# Altium project BinaryClock.PrjPCB
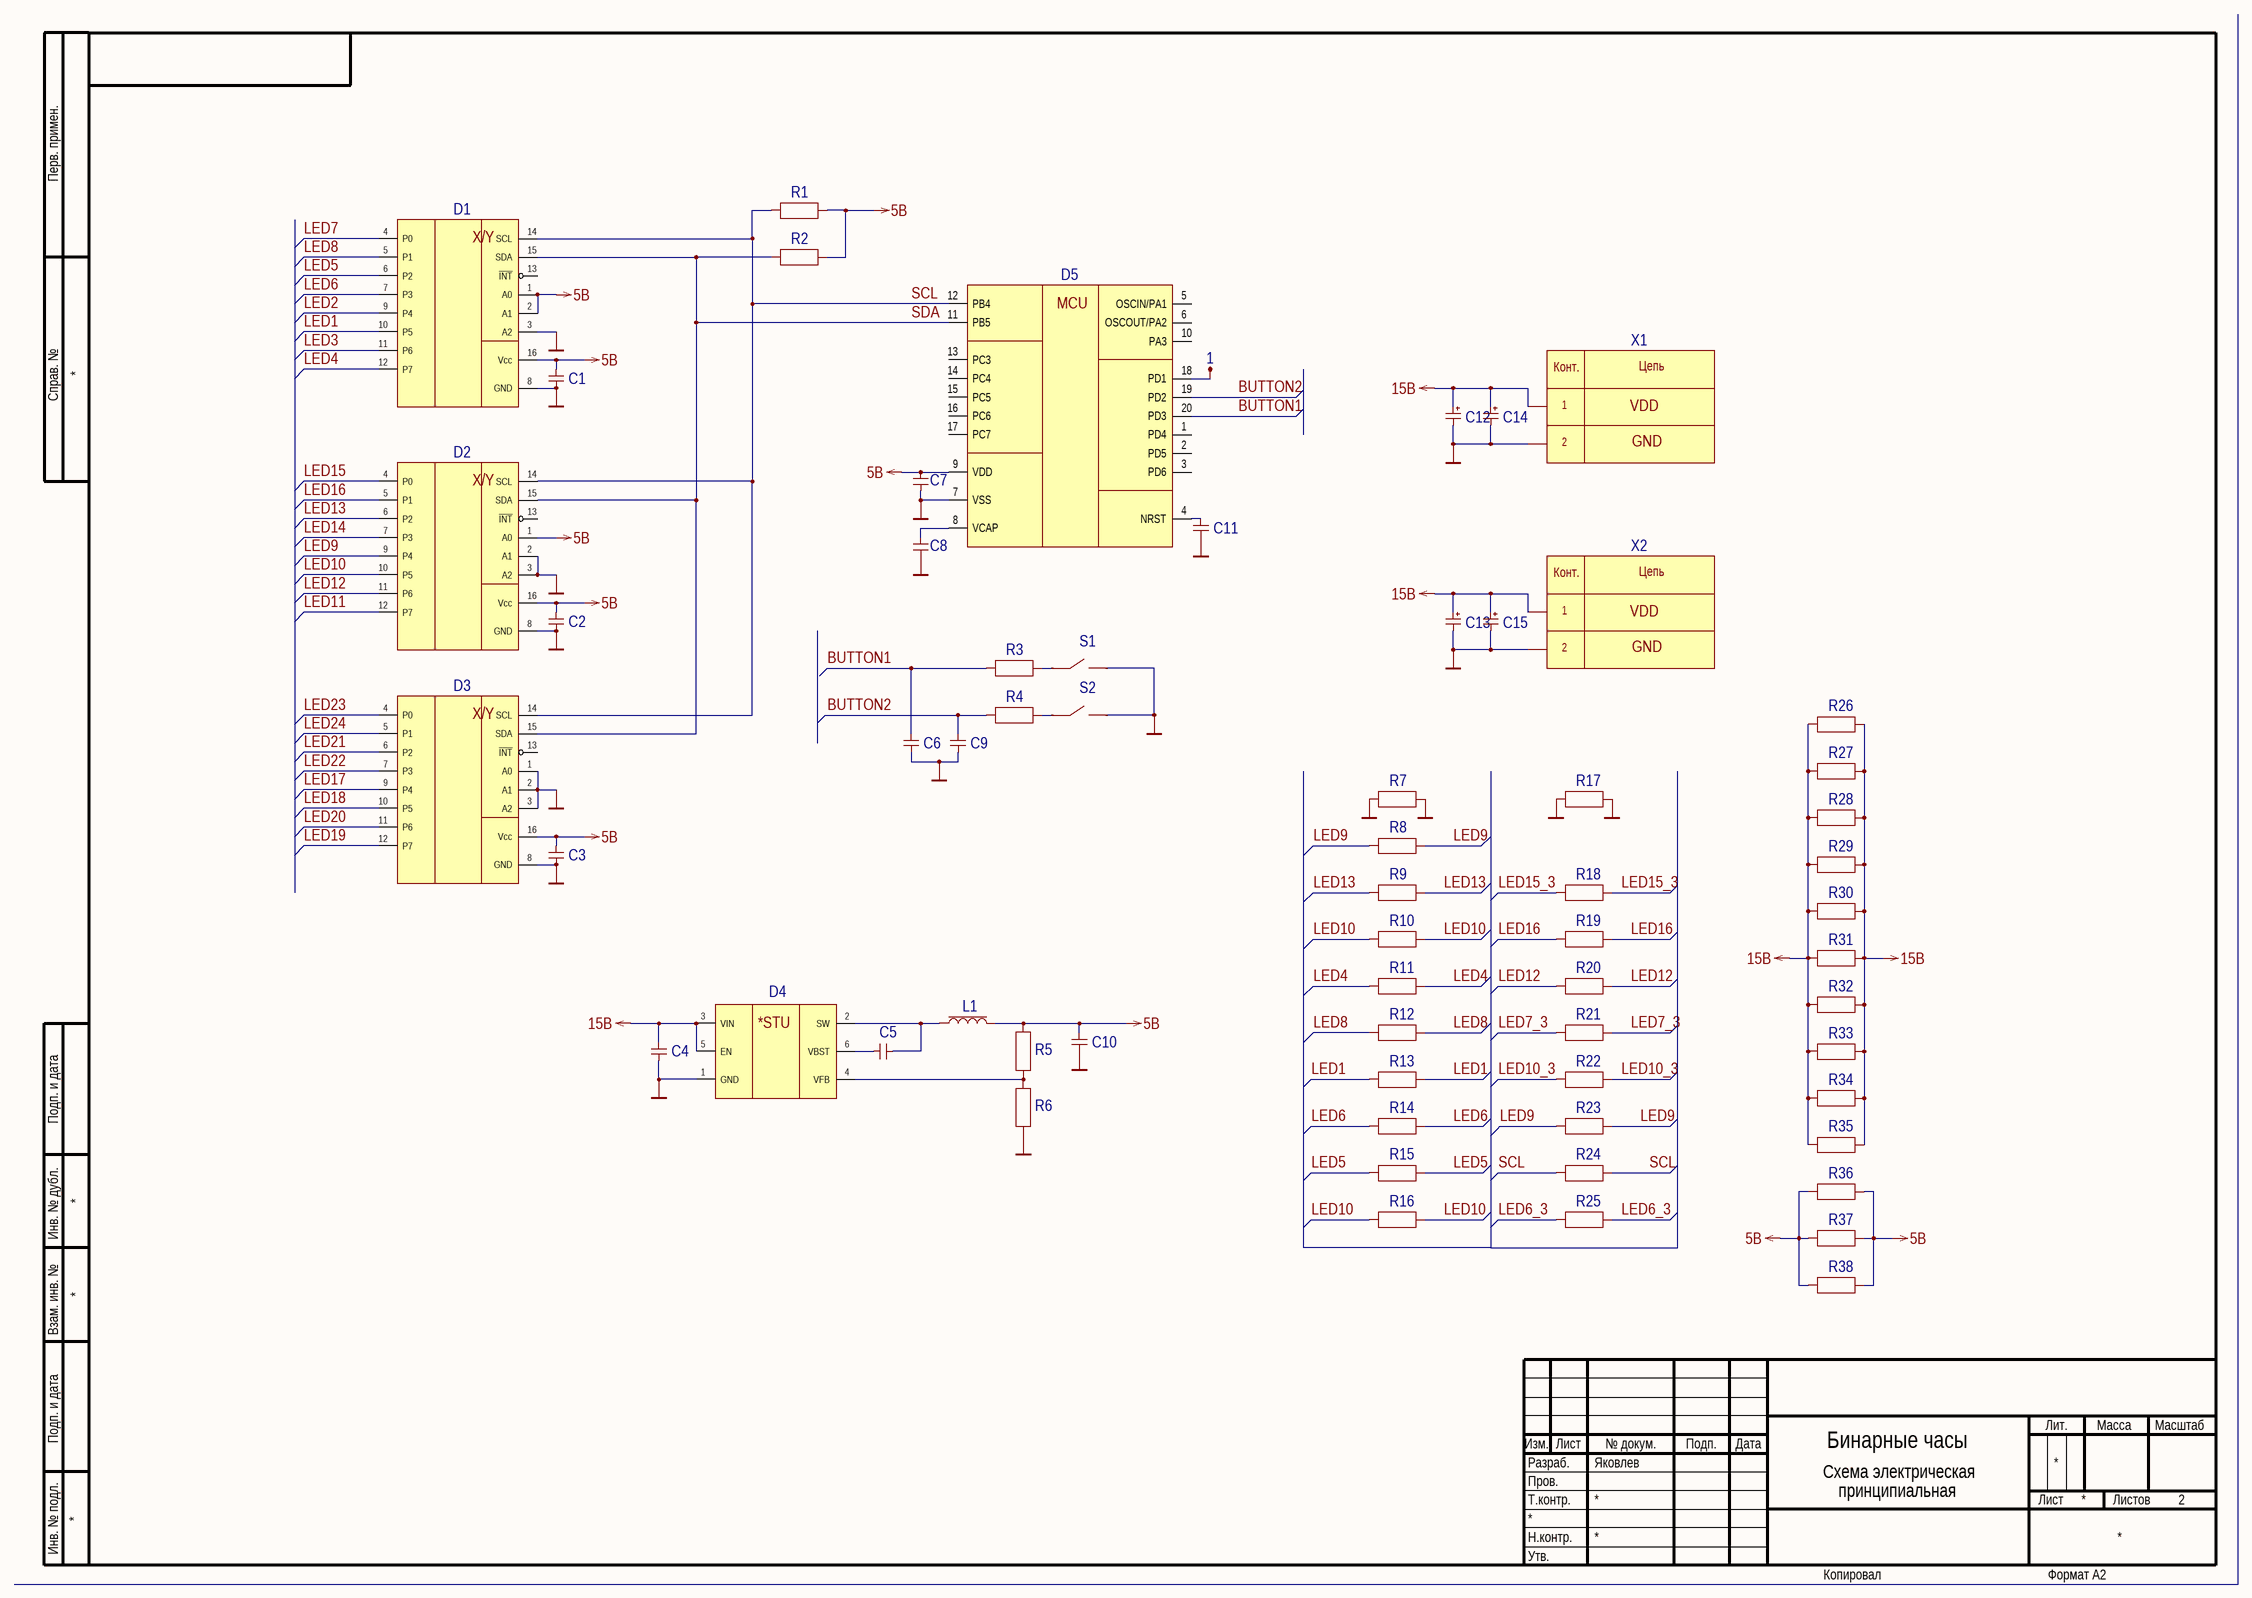
[diagram p0: BinaryClock_Control.SchDoc]
2 sheets, 112 parts. Net scope: global (net labels, ports and power ports of the same name join across sheets).
Board file: BinaryClock.PcbDoc
Sheets:
  BinaryClock_Control.SchDoc
  BinaryClock_LEDs.SchDoc

## Sheet BinaryClock_Control.SchDoc
size 594 x 420 mm; Scale: 1:1; Разраб.: Яковлев; Общее количество листов: 2; Наименование изделия 1: Бинарные часы; Наименование изделия 2: Схема электрическая; Наименование изделия 3: принципиальная

### Parts
1  Point  [point]  (value not drawn)
C1  0805-16 В-X7R-0,1мкФ±10 %  [SMD-0805C]  (value not drawn)
C2  0805-16 В-X7R-0,1мкФ±10 %  [SMD-0805C]  (value not drawn)
C3  0805-16 В-X7R-0,1мкФ±10 %  [SMD-0805C]  (value not drawn)
C4  1206-16 В-X7R-22мкФ±10 %  [SMD-1206C]  (value not drawn)
C5  0805-16 В-X7R-0,1мкФ±10 %  [SMD-0805C]  (value not drawn)
C6  0805-16 В-X7R-0,1мкФ±10 %  [SMD-0805C]  (value not drawn)
C7  0805-16 В-X7R-0,1мкФ±10 %  [SMD-0805C]  (value not drawn)
C8  0805-16 В-X7R-1мкФ±10 %  [SMD-0805C]  (value not drawn)
C9  0805-16 В-X7R-0,1мкФ±10 %  [SMD-0805C]  (value not drawn)
C10  1206-16 В-X7R-22мкФ±10 %  [SMD-1206C]  (value not drawn)
C11  0805-16 В-X7R-0,1мкФ±10 %  [SMD-0805C]  (value not drawn)
C12  D-20 В-47 мкФ±10 %  [CAP POL 2917/7343]  (value not drawn)
C13  D-20 В-47 мкФ±10 %  [CAP POL 2917/7343]  (value not drawn)
C14  D-20 В-47 мкФ±10 %  [CAP POL 2917/7343]  (value not drawn)
C15  D-20 В-47 мкФ±10 %  [CAP POL 2917/7343]  (value not drawn)
D1  PCF8574T/3.512  [SO-16]  (value not drawn)
D2  PCF8574T/3.512  [SO-16]  (value not drawn)
D3  PCF8574T/3.512  [SO-16]  (value not drawn)
D4  TPS562200DDCT  [SOT23-6_M]  (value not drawn)
D5  STM8S103F3P6  [TSSOP-20]  (value not drawn)
L1  NLCV32T-4R7M-EF  [1210_M]  (value not drawn)
R1  0805±5 %-10 кОм  [SMD-0805-RES]  (value not drawn)
R2  0805±5 %-10 кОм  [SMD-0805-RES]  (value not drawn)
R3  0805±5 %-100 Ом  [SMD-0805-RES]  (value not drawn)
R4  0805±5 %-100 Ом  [SMD-0805-RES]  (value not drawn)
R5  0805±1 %-56,2 кОм  [SMD-0805-RES]  (value not drawn)
R6  0805±1 %-10,2 кОм  [SMD-0805-RES]  (value not drawn)
R7  0805±5 %-0 Ом  [R1206]  (value not drawn)
R8  0805±5 %-0 Ом  [R1206]  (value not drawn)
R9  0805±5 %-0 Ом  [R1206]  (value not drawn)
R10  0805±5 %-0 Ом  [R1206]  (value not drawn)
R11  0805±5 %-0 Ом  [R1206]  (value not drawn)
R12  0805±5 %-0 Ом  [R1206]  (value not drawn)
R13  0805±5 %-0 Ом  [R1206]  (value not drawn)
R14  0805±5 %-0 Ом  [R1206]  (value not drawn)
R15  0805±5 %-0 Ом  [R1206]  (value not drawn)
R16  0805±5 %-0 Ом  [R1206]  (value not drawn)
R17  0805±5 %-0 Ом  [R1206]  (value not drawn)
R18  0805±5 %-0 Ом  [R1206]  (value not drawn)
R19  0805±5 %-0 Ом  [R1206]  (value not drawn)
R20  0805±5 %-0 Ом  [R1206]  (value not drawn)
R21  0805±5 %-0 Ом  [R1206]  (value not drawn)
R22  0805±5 %-0 Ом  [R1206]  (value not drawn)
R23  0805±5 %-0 Ом  [R1206]  (value not drawn)
R24  0805±5 %-0 Ом  [R1206]  (value not drawn)
R25  0805±5 %-0 Ом  [R1206]  (value not drawn)
R26  0805±5 %-0 Ом  [R1206]  (value not drawn)
R27  0805±5 %-0 Ом  [R1206]  (value not drawn)
R28  0805±5 %-0 Ом  [R1206]  (value not drawn)
R29  0805±5 %-0 Ом  [R1206]  (value not drawn)
R30  0805±5 %-0 Ом  [R1206]  (value not drawn)
R31  0805±5 %-0 Ом  [R1206]  (value not drawn)
R32  0805±5 %-0 Ом  [R1206]  (value not drawn)
R33  0805±5 %-0 Ом  [R1206]  (value not drawn)
R34  0805±5 %-0 Ом  [R1206]  (value not drawn)
R35  0805±5 %-0 Ом  [R1206]  (value not drawn)
R36  0805±5 %-0 Ом  [R1206]  (value not drawn)
R37  0805±5 %-0 Ом  [R1206]  (value not drawn)
R38  0805±5 %-0 Ом  [R1206]  (value not drawn)
S1  1243SHIM-160G-G  [1243S]  (value not drawn)
S2  1243SHIM-160G-G  [1243S]  (value not drawn)
X1  RASM712X  [RASM712]  (value not drawn)
X2  RASM712X  [RASM712]  (value not drawn)

### Nets
5В: C1.2 C2.2 C3.2 C7.2 C10.2 D1.1(A0) D1.2(A1) D1.16(Vcc) D2.1(A0) D2.16(Vcc) D3.16(Vcc) D5.9(VDD) L1.2 R1.2 R2.2 R5.2 R36.1 R36.2 R37.1 R37.2 R38.1 R38.2
15В: C4.2 C12.1 C13.1 C14.1 C15.1 D4.3(VIN) D4.5(EN) R26.1 R26.2 R27.1 R27.2 R28.1 R28.2 R29.1 R29.2 R30.1 R30.2 R31.1 R31.2 R32.1 R32.2 R33.1 R33.2 R34.1 R34.2 R35.1 R35.2 X1.1 X2.1
GND: C1.1 C2.1 C3.1 C4.1 C6.1 C7.1 C8.1 C9.1 C10.1 C11.1 C12.2 C13.2 C14.2 C15.2 D1.3(A2) D1.8(GND) D2.2(A1) D2.3(A2) D2.8(GND) D3.1(A0) D3.2(A1) D3.3(A2) D3.8(GND) D4.1(GND) D5.7(VSS) R6.1 R7.1 R7.2 R17.1 R17.2 S1.2 S2.2 X1.2 X2.2
BUTTON1: C6.2 D5.20(PD3) R3.1
BUTTON2: C9.2 D5.19(PD2) R4.1
LED1: D1.10(P5) R13.1 R13.2
LED2: D1.9(P4)
LED3: D1.11(P6)
LED4: D1.12(P7) R11.1 R11.2
LED5: D1.6(P2) R15.1 R15.2
LED6: D1.7(P3) R14.1 R14.2
LED6_3: R25.1 R25.2
LED7: D1.4(P0)
LED7_3: R21.1 R21.2
LED8: D1.5(P1) R12.1 R12.2
LED9: D2.9(P4) R8.1 R8.2 R23.1 R23.2
LED10: D2.10(P5) R10.1 R10.2 R16.1 R16.2
LED10_3: R22.1 R22.2
LED11: D2.12(P7)
LED12: D2.11(P6) R20.1 R20.2
LED13: D2.6(P2) R9.1 R9.2
LED14: D2.7(P3)
LED15: D2.4(P0)
LED15_3: R18.1 R18.2
LED16: D2.5(P1) R19.1 R19.2
LED17: D3.9(P4)
LED18: D3.10(P5)
LED19: D3.12(P7)
LED20: D3.11(P6)
LED21: D3.6(P2)
LED22: D3.7(P3)
LED23: D3.4(P0)
LED24: D3.5(P1)
SCL: D1.14(SCL) D2.14(SCL) D3.14(SCL) D5.12(PB4) R1.1 R24.1 R24.2
SDA: D1.15(SDA) D2.15(SDA) D3.15(SDA) D5.11(PB5) R2.1
Net1_1: 1.1 D5.18(PD1)
NetC5_1: C5.1 D4.2(SW) L1.1
NetC5_2: C5.2 D4.6(VBST)
NetC8_2: C8.2 D5.8(VCAP)
NetC11_2: C11.2 D5.4(NRST)
NetD4_4: D4.4(VFB) R5.1 R6.2
NetR3_2: R3.2 S1.1
NetR4_2: R4.2 S2.1

Not connected (* = marked no-connect by the designer): D1 13(~{INT}); D2 13(~{INT}); D3 13(~{INT}); D5 1(PD4) 2(PD5) 3(PD6) 5(OSCIN/PA1) 6(OSCOUT/PA2) 10(PA3) 13(PC3) 14(PC4) 15(PC5) 16(PC6) 17(PC7)

### Notes on the sheet
- VDD
- GND
- Перв. примен.
- Справ. №
- Подп. и дата
- Инв. № дубл.
- Взам. инв. №
- Разраб.
- Изм.
- Лист
- № докум.
- Подп.
- Дата
- Лит.
- Масса
- Масштаб
- Пров.
- Т.контр.
- Листов
- Инв. № подл.
- Утв.
- Н.контр.
- Копировал
- Формат А2
- (in symbol PCF8574) X/Y
- (in symbol RASM712X) Цепь; Конт.
- (in symbol STM8S103FxP) MCU
- (in symbol TPS562200) *STU

### Library data of the parts
C1-C3 C5-C7 C9 C11 = Cap: Capacitor; Manufacturer: Murata; Value: 0,1 мкФ; ComponentLink1Description: Datasheet
C4 C10 = Cap: Capacitor; Value: 22 мкФ; Manufacturer: *; ComponentLink1Description: Datasheet
C8 = Cap: Capacitor; Manufacturer: Murata; Value: 1 мкФ; ComponentLink1Description: Datasheet
C12-C15 = Cap_el: Electrolytic capacitor; Value: 47 мкФ; Manufacturer: *; ComponentLink1Description: Datasheet
D1-D3 = PCF8574: Remote 8-bit I/O expander for I2C bus; Manufacturer: NXP; ComponentLink1Description: Datasheet; ComponentLink1URL: https://www.nxp.com/docs/en/data-sheet/PCF8574_PCF8574A.pdf
D4 = TPS562200: 4.5-V To 17-V Input, 2-A, 3-A Synchronous Step-Down Voltage Regulator; Manufacturer: Texas Instruments; ComponentLink1Description: Datasheet; ComponentLink1URL: http://www.ti.com/lit/ds/symlink/tps562200.pdf
D5 = STM8S103FxP: Access line, 16 MHz STM8S 8-bit MCU, up to 8 Kbytes Flash,   data EEPROM,10-bit ADC, 3 timers, UART, SPI, I²C; Manufacturer: STMicroelectronics; ComponentLink1Description: Datasheet; ComponentLink1URL: http://www.st.com/content/ccc/resource/technical/document/datasheet/ce/13/13/03/a9/a4/42/8f/CD00226640.pdf/files/CD00226640.pdf/jcr:content/translations/en.CD00226640.pdf
L1 = Inductor: Manufacturer: TDK; Value: 4,7 мкГн; ComponentLink1Description: Datasheet; ComponentLink1URL: https://product.tdk.com/info/en/catalog/datasheets/inductor_commercial_decoupling_nlcv32-ef_en.pdf
R1 R2 = Res: Resistor; Value: 10 кОм; ComponentLink1Description: Datasheet
  R1: Manufacturer: *
R3 R4 = Res: Resistor; Value: 100 Ом; Manufacturer: *; ComponentLink1Description: Datasheet
R5 R6 = Res: Resistor; Manufacturer: *; ComponentLink1Description: Datasheet
  R5: Value: 56,2 кОм
  R6: Value: 10,2 кОм
R7-R38 = Res: Resistor; Value: 0 Ом; Manufacturer: *; ComponentLink1Description: Datasheet
S1 S2 = button: Tact button SPST; Manufacturer: Switronic; ComponentLink1Description: Datasheet; ComponentLink1URL: http://www.voltmaster.ru/pdf/datasheets/switronic/Cata_A09.gif
X1 X2 = RASM712X: Power jack 2.5 mm SMD connector; Manufacturer: Switchcraft; ComponentLink1Description: Datasheet; ComponentLink1URL: http://www.farnell.com/cad/526481.pdf

## Sheet BinaryClock_LEDs.SchDoc
size 594 x 420 mm; Scale: 1:1; Разраб.: Яковлев; Номер листа: 2; Наименование изделия 1: Бинарные часы; Наименование изделия 2: Схема электрическая; Наименование изделия 3: принципиальная
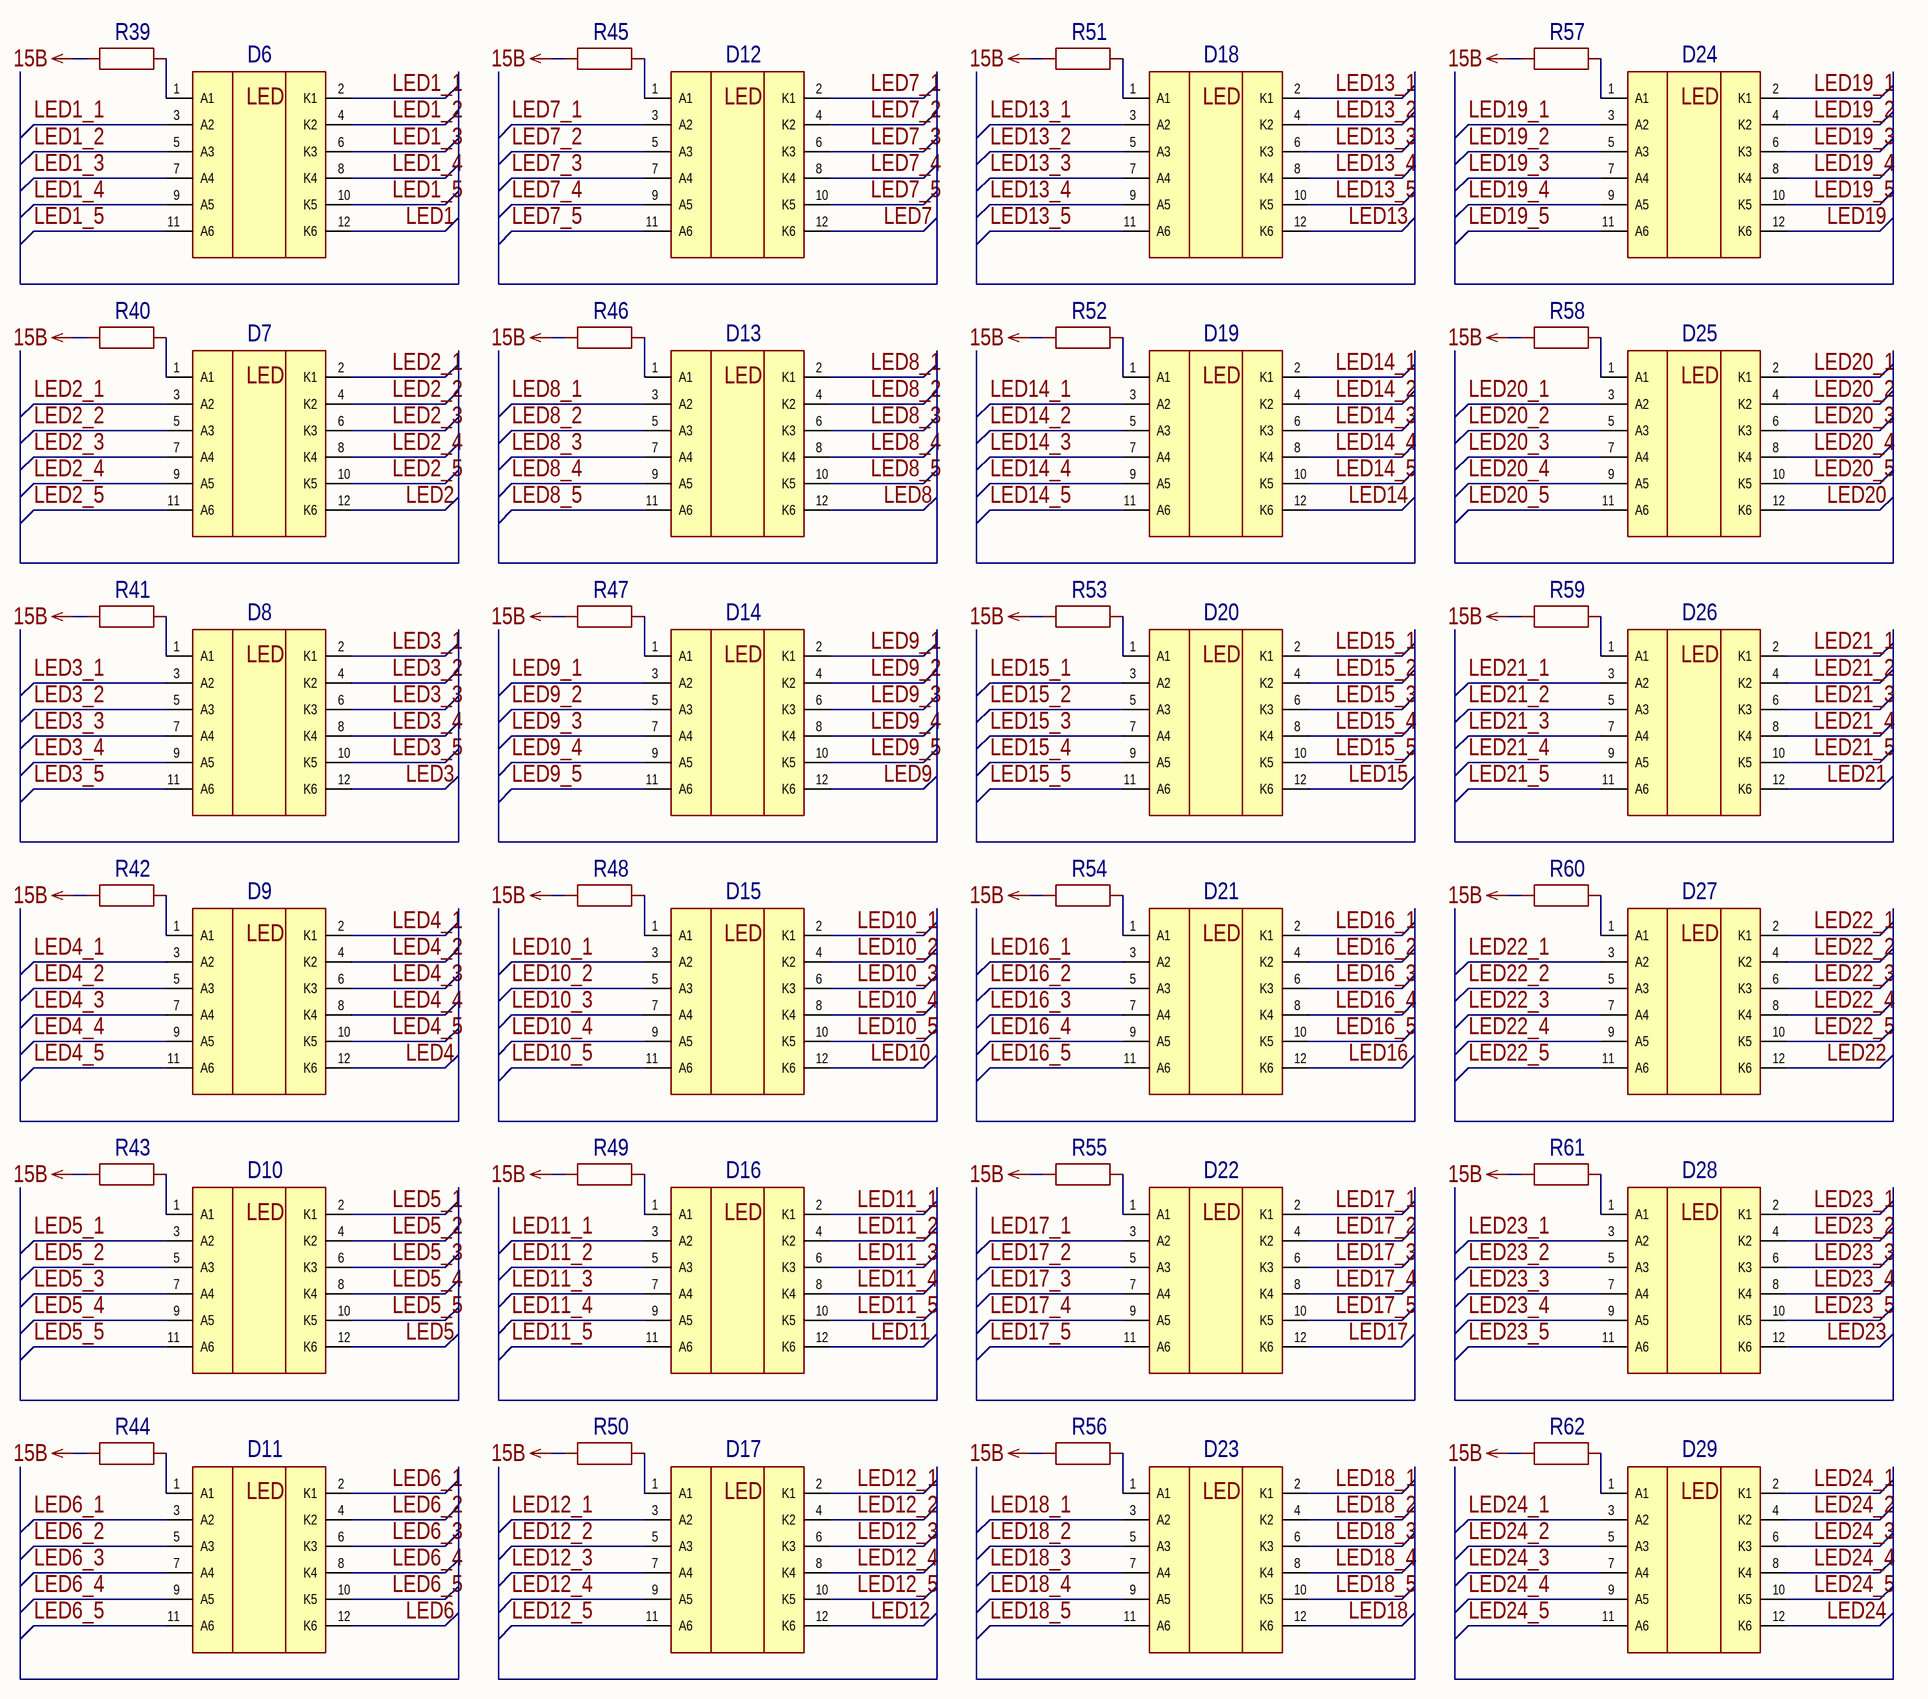
[diagram p1: BinaryClock_LEDs.SchDoc]

### Parts
D6  DLA/6ID  [DLA/6ID]  (value not drawn)
D7  DLA/6ID  [DLA/6ID]  (value not drawn)
D8  DLA/6ID  [DLA/6ID]  (value not drawn)
D9  DLA/6ID  [DLA/6ID]  (value not drawn)
D10  DLA/6ID  [DLA/6ID]  (value not drawn)
D11  DLA/6ID  [DLA/6ID]  (value not drawn)
D12  DLA/6ID  [DLA/6ID]  (value not drawn)
D13  DLA/6ID  [DLA/6ID]  (value not drawn)
D14  DLA/6YD  [DLA/6YD]  (value not drawn)
D15  DLA/6YD  [DLA/6YD]  (value not drawn)
D16  DLA/6YD  [DLA/6YD]  (value not drawn)
D17  DLA/6YD  [DLA/6YD]  (value not drawn)
D18  DLA/6YD  [DLA/6YD]  (value not drawn)
D19  DLA/6YD  [DLA/6YD]  (value not drawn)
D20  DLA/6YD  [DLA/6YD]  (value not drawn)
D21  DLA/6YD  [DLA/6YD]  (value not drawn)
D22  DLA/6GD  [DLA/6GD]  (value not drawn)
D23  DLA/6GD  [DLA/6GD]  (value not drawn)
D24  DLA/6GD  [DLA/6GD]  (value not drawn)
D25  DLA/6GD  [DLA/6GD]  (value not drawn)
D26  DLA/6GD  [DLA/6GD]  (value not drawn)
D27  DLA/6GD  [DLA/6GD]  (value not drawn)
D28  DLA/6GD  [DLA/6GD]  (value not drawn)
D29  DLA/6GD  [DLA/6GD]  (value not drawn)
R39  0805±1 %-? кОм  [SMD-0805-RES]  (value not drawn)
R40  0805±1 %-? кОм  [SMD-0805-RES]  (value not drawn)
R41  0805±1 %-? кОм  [SMD-0805-RES]  (value not drawn)
R42  0805±1 %-? кОм  [SMD-0805-RES]  (value not drawn)
R43  0805±1 %-? кОм  [SMD-0805-RES]  (value not drawn)
R44  0805±1 %-? кОм  [SMD-0805-RES]  (value not drawn)
R45  0805±1 %-? кОм  [SMD-0805-RES]  (value not drawn)
R46  0805±1 %-? кОм  [SMD-0805-RES]  (value not drawn)
R47  0805±1 %-? кОм  [SMD-0805-RES]  (value not drawn)
R48  0805±1 %-? кОм  [SMD-0805-RES]  (value not drawn)
R49  0805±1 %-? кОм  [SMD-0805-RES]  (value not drawn)
R50  0805±1 %-? кОм  [SMD-0805-RES]  (value not drawn)
R51  0805±1 %-? кОм  [SMD-0805-RES]  (value not drawn)
R52  0805±1 %-? кОм  [SMD-0805-RES]  (value not drawn)
R53  0805±1 %-? кОм  [SMD-0805-RES]  (value not drawn)
R54  0805±1 %-? кОм  [SMD-0805-RES]  (value not drawn)
R55  0805±1 %-? кОм  [SMD-0805-RES]  (value not drawn)
R56  0805±1 %-? кОм  [SMD-0805-RES]  (value not drawn)
R57  0805±1 %-? кОм  [SMD-0805-RES]  (value not drawn)
R58  0805±1 %-? кОм  [SMD-0805-RES]  (value not drawn)
R59  0805±1 %-? кОм  [SMD-0805-RES]  (value not drawn)
R60  0805±1 %-? кОм  [SMD-0805-RES]  (value not drawn)
R61  0805±1 %-? кОм  [SMD-0805-RES]  (value not drawn)
R62  0805±1 %-? кОм  [SMD-0805-RES]  (value not drawn)

### Nets
15В: R39.1 R40.1 R41.1 R42.1 R43.1 R44.1 R45.1 R46.1 R47.1 R48.1 R49.1 R50.1 R51.1 R52.1 R53.1 R54.1 R55.1 R56.1 R57.1 R58.1 R59.1 R60.1 R61.1 R62.1
LED1: D6.12(K6)
LED1_1: D6.2(K1) D6.3(A2)
LED1_2: D6.4(K2) D6.5(A3)
LED1_3: D6.6(K3) D6.7(A4)
LED1_4: D6.8(K4) D6.9(A5)
LED1_5: D6.10(K5) D6.11(A6)
LED2: D7.12(K6)
LED2_1: D7.2(K1) D7.3(A2)
LED2_2: D7.4(K2) D7.5(A3)
LED2_3: D7.6(K3) D7.7(A4)
LED2_4: D7.8(K4) D7.9(A5)
LED2_5: D7.10(K5) D7.11(A6)
LED3: D8.12(K6)
LED3_1: D8.2(K1) D8.3(A2)
LED3_2: D8.4(K2) D8.5(A3)
LED3_3: D8.6(K3) D8.7(A4)
LED3_4: D8.8(K4) D8.9(A5)
LED3_5: D8.10(K5) D8.11(A6)
LED4: D9.12(K6)
LED4_1: D9.2(K1) D9.3(A2)
LED4_2: D9.4(K2) D9.5(A3)
LED4_3: D9.6(K3) D9.7(A4)
LED4_4: D9.8(K4) D9.9(A5)
LED4_5: D9.10(K5) D9.11(A6)
LED5: D10.12(K6)
LED5_1: D10.2(K1) D10.3(A2)
LED5_2: D10.4(K2) D10.5(A3)
LED5_3: D10.6(K3) D10.7(A4)
LED5_4: D10.8(K4) D10.9(A5)
LED5_5: D10.10(K5) D10.11(A6)
LED6: D11.12(K6)
LED6_1: D11.2(K1) D11.3(A2)
LED6_2: D11.4(K2) D11.5(A3)
LED6_3: D11.6(K3) D11.7(A4)
LED6_4: D11.8(K4) D11.9(A5)
LED6_5: D11.10(K5) D11.11(A6)
LED7: D12.12(K6)
LED7_1: D12.2(K1) D12.3(A2)
LED7_2: D12.4(K2) D12.5(A3)
LED7_3: D12.6(K3) D12.7(A4)
LED7_4: D12.8(K4) D12.9(A5)
LED7_5: D12.10(K5) D12.11(A6)
LED8: D13.12(K6)
LED8_1: D13.2(K1) D13.3(A2)
LED8_2: D13.4(K2) D13.5(A3)
LED8_3: D13.6(K3) D13.7(A4)
LED8_4: D13.8(K4) D13.9(A5)
LED8_5: D13.10(K5) D13.11(A6)
LED9: D14.12(K6)
LED9_1: D14.2(K1) D14.3(A2)
LED9_2: D14.4(K2) D14.5(A3)
LED9_3: D14.6(K3) D14.7(A4)
LED9_4: D14.8(K4) D14.9(A5)
LED9_5: D14.10(K5) D14.11(A6)
LED10: D15.12(K6)
LED10_1: D15.2(K1) D15.3(A2)
LED10_2: D15.4(K2) D15.5(A3)
LED10_3: D15.6(K3) D15.7(A4)
LED10_4: D15.8(K4) D15.9(A5)
LED10_5: D15.10(K5) D15.11(A6)
LED11: D16.12(K6)
LED11_1: D16.2(K1) D16.3(A2)
LED11_2: D16.4(K2) D16.5(A3)
LED11_3: D16.6(K3) D16.7(A4)
LED11_4: D16.8(K4) D16.9(A5)
LED11_5: D16.10(K5) D16.11(A6)
LED12: D17.12(K6)
LED12_1: D17.2(K1) D17.3(A2)
LED12_2: D17.4(K2) D17.5(A3)
LED12_3: D17.6(K3) D17.7(A4)
LED12_4: D17.8(K4) D17.9(A5)
LED12_5: D17.10(K5) D17.11(A6)
LED13: D18.12(K6)
LED13_1: D18.2(K1) D18.3(A2)
LED13_2: D18.4(K2) D18.5(A3)
LED13_3: D18.6(K3) D18.7(A4)
LED13_4: D18.8(K4) D18.9(A5)
LED13_5: D18.10(K5) D18.11(A6)
LED14: D19.12(K6)
LED14_1: D19.2(K1) D19.3(A2)
LED14_2: D19.4(K2) D19.5(A3)
LED14_3: D19.6(K3) D19.7(A4)
LED14_4: D19.8(K4) D19.9(A5)
LED14_5: D19.10(K5) D19.11(A6)
LED15: D20.12(K6)
LED15_1: D20.2(K1) D20.3(A2)
LED15_2: D20.4(K2) D20.5(A3)
LED15_3: D20.6(K3) D20.7(A4)
LED15_4: D20.8(K4) D20.9(A5)
LED15_5: D20.10(K5) D20.11(A6)
LED16: D21.12(K6)
LED16_1: D21.2(K1) D21.3(A2)
LED16_2: D21.4(K2) D21.5(A3)
LED16_3: D21.6(K3) D21.7(A4)
LED16_4: D21.8(K4) D21.9(A5)
LED16_5: D21.10(K5) D21.11(A6)
LED17: D22.12(K6)
LED17_1: D22.2(K1) D22.3(A2)
LED17_2: D22.4(K2) D22.5(A3)
LED17_3: D22.6(K3) D22.7(A4)
LED17_4: D22.8(K4) D22.9(A5)
LED17_5: D22.10(K5) D22.11(A6)
LED18: D23.12(K6)
LED18_1: D23.2(K1) D23.3(A2)
LED18_2: D23.4(K2) D23.5(A3)
LED18_3: D23.6(K3) D23.7(A4)
LED18_4: D23.8(K4) D23.9(A5)
LED18_5: D23.10(K5) D23.11(A6)
LED19: D24.12(K6)
LED19_1: D24.2(K1) D24.3(A2)
LED19_2: D24.4(K2) D24.5(A3)
LED19_3: D24.6(K3) D24.7(A4)
LED19_4: D24.8(K4) D24.9(A5)
LED19_5: D24.10(K5) D24.11(A6)
LED20: D25.12(K6)
LED20_1: D25.2(K1) D25.3(A2)
LED20_2: D25.4(K2) D25.5(A3)
LED20_3: D25.6(K3) D25.7(A4)
LED20_4: D25.8(K4) D25.9(A5)
LED20_5: D25.10(K5) D25.11(A6)
LED21: D26.12(K6)
LED21_1: D26.2(K1) D26.3(A2)
LED21_2: D26.4(K2) D26.5(A3)
LED21_3: D26.6(K3) D26.7(A4)
LED21_4: D26.8(K4) D26.9(A5)
LED21_5: D26.10(K5) D26.11(A6)
LED22: D27.12(K6)
LED22_1: D27.2(K1) D27.3(A2)
LED22_2: D27.4(K2) D27.5(A3)
LED22_3: D27.6(K3) D27.7(A4)
LED22_4: D27.8(K4) D27.9(A5)
LED22_5: D27.10(K5) D27.11(A6)
LED23: D28.12(K6)
LED23_1: D28.2(K1) D28.3(A2)
LED23_2: D28.4(K2) D28.5(A3)
LED23_3: D28.6(K3) D28.7(A4)
LED23_4: D28.8(K4) D28.9(A5)
LED23_5: D28.10(K5) D28.11(A6)
LED24: D29.12(K6)
LED24_1: D29.2(K1) D29.3(A2)
LED24_2: D29.4(K2) D29.5(A3)
LED24_3: D29.6(K3) D29.7(A4)
LED24_4: D29.8(K4) D29.9(A5)
LED24_5: D29.10(K5) D29.11(A6)
NetD6_1: D6.1(A1) R39.2
NetD7_1: D7.1(A1) R40.2
NetD8_1: D8.1(A1) R41.2
NetD9_1: D9.1(A1) R42.2
NetD10_1: D10.1(A1) R43.2
NetD11_1: D11.1(A1) R44.2
NetD12_1: D12.1(A1) R45.2
NetD13_1: D13.1(A1) R46.2
NetD14_1: D14.1(A1) R47.2
NetD15_1: D15.1(A1) R48.2
NetD16_1: D16.1(A1) R49.2
NetD17_1: D17.1(A1) R50.2
NetD18_1: D18.1(A1) R51.2
NetD19_1: D19.1(A1) R52.2
NetD20_1: D20.1(A1) R53.2
NetD21_1: D21.1(A1) R54.2
NetD22_1: D22.1(A1) R55.2
NetD23_1: D23.1(A1) R56.2
NetD24_1: D24.1(A1) R57.2
NetD25_1: D25.1(A1) R58.2
NetD26_1: D26.1(A1) R59.2
NetD27_1: D27.1(A1) R60.2
NetD28_1: D28.1(A1) R61.2
NetD29_1: D29.1(A1) R62.2

### Notes on the sheet
- Подп. и дата
- Инв. № дубл.
- Взам. инв. №
- Инв. № подл.
- Изм.
- Лист
- № докум.
- Подп.
- Дата
- Копировал
- Формат А2
- (in symbol DLA) LED

### Library data of the parts
D6-D29 = DLA: 20mm BIG LAMP; Manufacturer: Kingbright; ComponentLink1Description: Datasheet
  D6-D13: ComponentLink1URL: http://www.kingbright.com/attachments/file/psearch/000/00/00/DLA-6ID(Ver.14A).pdf
  D14-D21: ComponentLink1URL: http://www.kingbright.com/attachments/file/psearch/000/00/20160808bak/DLA-6YD(Ver.12A).pdf
  D22-D29: ComponentLink1URL: http://www.kingbright.com/attachments/file/psearch/000/00/00/DLA-6GD(Ver.14A).pdf
R39-R62 = Res: Resistor; Value: ? Ом; Manufacturer: *; ComponentLink1Description: Datasheet

## Nets that join several sheets
15В: BinaryClock_Control (29 pins), BinaryClock_LEDs (24 pins)
LED1: BinaryClock_Control (D1.10 R13.1 R13.2), BinaryClock_LEDs (D6.12)
LED2: BinaryClock_Control (D1.9), BinaryClock_LEDs (D7.12)
LED3: BinaryClock_Control (D1.11), BinaryClock_LEDs (D8.12)
LED4: BinaryClock_Control (D1.12 R11.1 R11.2), BinaryClock_LEDs (D9.12)
LED5: BinaryClock_Control (D1.6 R15.1 R15.2), BinaryClock_LEDs (D10.12)
LED6: BinaryClock_Control (D1.7 R14.1 R14.2), BinaryClock_LEDs (D11.12)
LED6_3: BinaryClock_Control (R25.1 R25.2), BinaryClock_LEDs (D11.6 D11.7)
LED7: BinaryClock_Control (D1.4), BinaryClock_LEDs (D12.12)
LED7_3: BinaryClock_Control (R21.1 R21.2), BinaryClock_LEDs (D12.6 D12.7)
LED8: BinaryClock_Control (D1.5 R12.1 R12.2), BinaryClock_LEDs (D13.12)
LED9: BinaryClock_Control (5 pins), BinaryClock_LEDs (D14.12)
LED10: BinaryClock_Control (5 pins), BinaryClock_LEDs (D15.12)
LED10_3: BinaryClock_Control (R22.1 R22.2), BinaryClock_LEDs (D15.6 D15.7)
LED11: BinaryClock_Control (D2.12), BinaryClock_LEDs (D16.12)
LED12: BinaryClock_Control (D2.11 R20.1 R20.2), BinaryClock_LEDs (D17.12)
LED13: BinaryClock_Control (D2.6 R9.1 R9.2), BinaryClock_LEDs (D18.12)
LED14: BinaryClock_Control (D2.7), BinaryClock_LEDs (D19.12)
LED15: BinaryClock_Control (D2.4), BinaryClock_LEDs (D20.12)
LED15_3: BinaryClock_Control (R18.1 R18.2), BinaryClock_LEDs (D20.6 D20.7)
LED16: BinaryClock_Control (D2.5 R19.1 R19.2), BinaryClock_LEDs (D21.12)
LED17: BinaryClock_Control (D3.9), BinaryClock_LEDs (D22.12)
LED18: BinaryClock_Control (D3.10), BinaryClock_LEDs (D23.12)
LED19: BinaryClock_Control (D3.12), BinaryClock_LEDs (D24.12)
LED20: BinaryClock_Control (D3.11), BinaryClock_LEDs (D25.12)
LED21: BinaryClock_Control (D3.6), BinaryClock_LEDs (D26.12)
LED22: BinaryClock_Control (D3.7), BinaryClock_LEDs (D27.12)
LED23: BinaryClock_Control (D3.4), BinaryClock_LEDs (D28.12)
LED24: BinaryClock_Control (D3.5), BinaryClock_LEDs (D29.12)